# Altium schematic sheet Placa_Alimentación_9V.SchDoc
size A3
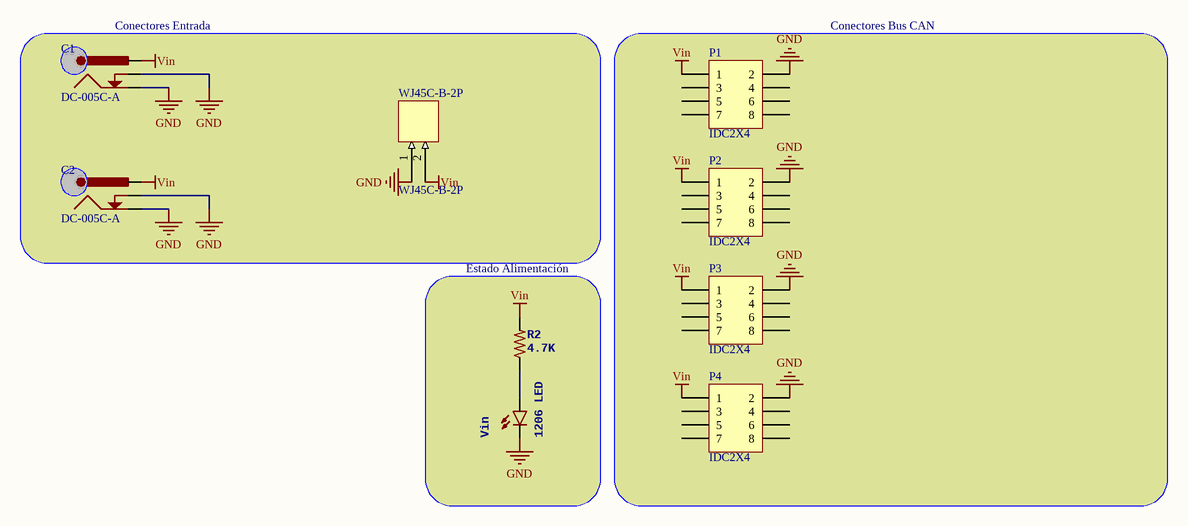
[diagram p0: Placa_Alimentación_9V.SchDoc]

## Parts
C1  DC-005C-A  [DC-005C-A]
C2  DC-005C-A  [DC-005C-A]
P1  IDC2X4  [IDC2X4]
P2  IDC2X4  [IDC2X4]
P3  IDC2X4  [IDC2X4]
P4  IDC2X4  [IDC2X4]
R2  4.7K  [0805]
Vin  1206 LED  [LED-1206]
WJ45C-B-2P  WJ45C-B-2P  [WJ45C-B-2P]

## Blocks framed on the sheet
Conectores Entrada: C1 C2 WJ45C-B-2P
Conectores Bus CAN: P1-P4
Estado Alimentación: R2 Vin

## Nets
GND: C1.2(SWITCH) C1.3(SHELL) C2.2(SWITCH) C2.3(SHELL) P1.2 P2.2 P3.2 P4.2 Vin.C WJ45C-B-2P.1
Vin: C1.1(PIN) C2.1(PIN) P1.1 P2.1 P3.1 P4.1 R2.2 WJ45C-B-2P.2
NetR2_1: R2.1 Vin.A

Not connected (* = marked no-connect by the designer): P1 3 4 5 6 7 8; P2 3 4 5 6 7 8; P3 3 4 5 6 7 8; P4 3 4 5 6 7 8

## Library data of the parts
P1-P4 = IDC2X4: Header, 4-Pin, Dual row; LatestRevisionDate: 17-Jul-2002; LatestRevisionNote: Re-released for DXP Platform.; Publisher: Altium Limited
R2 = RESISTOR0805-RES
Vin = LED1206